# Altium schematic sheet Sheet1.SchDoc
size A4; SheetNumber: 1; SheetTotal: 1
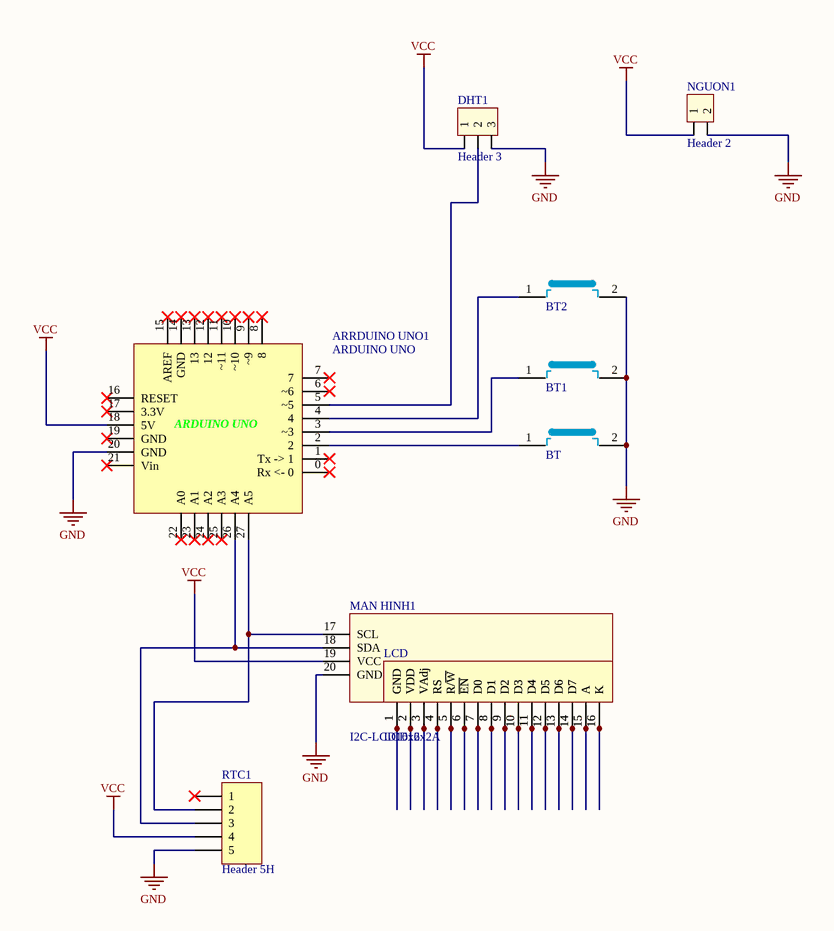
[diagram p0: Sheet1.SchDoc]

## Parts
ARRDUINO_UNO1  ARDUINO UNO  [ARDUINO UNO]
BT1  BT2  [SW4]
BT2  BT1  [SW4]
BT3  BT  [SW4]
DHT1  Header 3  [HED3]
LCD  LCD16x2A  [LCD16X2]
MAN_HINH1  I2C-LCD16x2  [I2C-LCD16X2]
NGUON1  Header 2  [HED2]
RTC1  Header 5H  [HDR1X5H]

## Nets
GND: ARRDUINO_UNO1.20(GND) BT1.2 BT2.2 BT3.2 DHT1.3 MAN_HINH1.20(GND) NGUON1.2 RTC1.5
VCC: ARRDUINO_UNO1.18(5V) DHT1.1 MAN_HINH1.19(VCC) NGUON1.1 RTC1.4
NetARRDUINO_UNO1_2: ARRDUINO_UNO1.2 BT3.1
NetARRDUINO_UNO1_3: ARRDUINO_UNO1.3(~3) BT2.1
NetARRDUINO_UNO1_4: ARRDUINO_UNO1.4 BT1.1
NetARRDUINO_UNO1_5: ARRDUINO_UNO1.5(~5) DHT1.2
NetARRDUINO_UNO1_26: ARRDUINO_UNO1.26(A4) MAN_HINH1.18(SDA) RTC1.3
NetARRDUINO_UNO1_27: ARRDUINO_UNO1.27(A5) MAN_HINH1.17(SCL) RTC1.2
NetLCD_1: LCD.1(GND) MAN_HINH1.1(GND)
NetLCD_2: LCD.2(VDD) MAN_HINH1.2(VDD)
NetLCD_3: LCD.3(VAdj) MAN_HINH1.3(VAdj)
NetLCD_4: LCD.4(RS) MAN_HINH1.4(RS)
NetLCD_5: LCD.5(R/~{W}) MAN_HINH1.5(R/~{W})
NetLCD_6: LCD.6(~{EN}) MAN_HINH1.6(~{EN})
NetLCD_7: LCD.7(D0) MAN_HINH1.7(D0)
NetLCD_8: LCD.8(D1) MAN_HINH1.8(D1)
NetLCD_9: LCD.9(D2) MAN_HINH1.9(D2)
NetLCD_10: LCD.10(D3) MAN_HINH1.10(D3)
NetLCD_11: LCD.11(D4) MAN_HINH1.11(D4)
NetLCD_12: LCD.12(D5) MAN_HINH1.12(D5)
NetLCD_13: LCD.13(D6) MAN_HINH1.13(D6)
NetLCD_14: LCD.14(D7) MAN_HINH1.14(D7)
NetLCD_15: LCD.15(A) MAN_HINH1.15(A)
NetLCD_16: LCD.16(K) MAN_HINH1.16(K)

Not connected (* = marked no-connect by the designer): ARRDUINO_UNO1 0(Rx_<-_0)* 1(Tx_->_1)* 6(~6)* 7* 8* 9(~9)* 10(~10)* 11(~11)* 12* 13* 14(GND)* 15(AREF)* 16(RESET)* 17(3.3V)* 19(GND)* 21(Vin)* 22(A0)* 23(A1)* 24(A2)* 25(A3)*; RTC1 1*

## Library data of the parts
BT1-BT3 = BUTTON
DHT1 = Hed3: Header 3 (Green); Value: Header 3
LCD = LCD16x2: LCD dipslay 16 char, 2 line; Value: LCD16x2A
MAN_HINH1 = I2C-LCD16x2: LCD dipslay 16 char, 2 line; Value: LCD16x2A
NGUON1 = Header 2: Header 2 (Green); Value: Header 2
RTC1 = Header 5H: Header, 5-Pin, Right Angle; LatestRevisionDate: 17-Jul-2002; LatestRevisionNote: Re-released for DXP Platform.; Publisher: Altium Limited